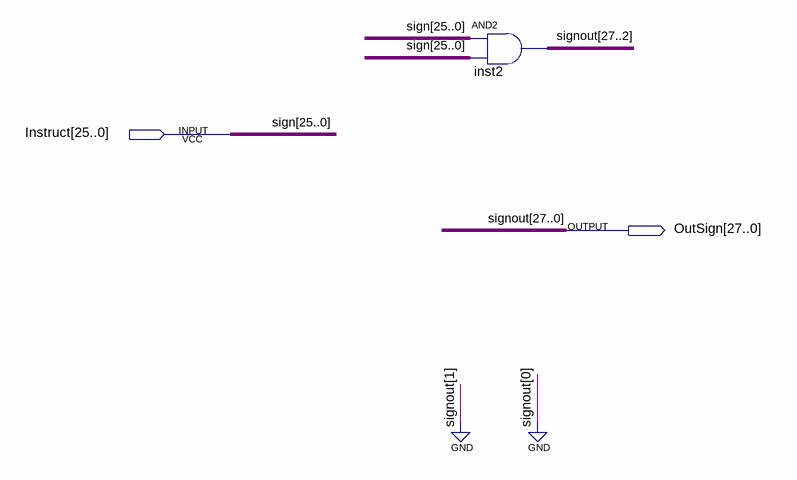
[diagram p0: schematic sheet]
// Quartus schematic jumpshift.bdf as structural Verilog: 1 symbols, 2 pins
module jumpshift (
  input  [25:0] Instruct,
  output [27:0] OutSign
);

  assign OutSign[27:2] = Instruct & Instruct;  // AND2 inst2, 26 bits wide

  assign OutSign[1:0] = 2'b00;

  // Other names for the same wires on the sheet: sign[25:0] = Instruct; signout[27:2] = OutSign[27:2]
endmodule
